# Altium project MotorDriver.PrjPCB
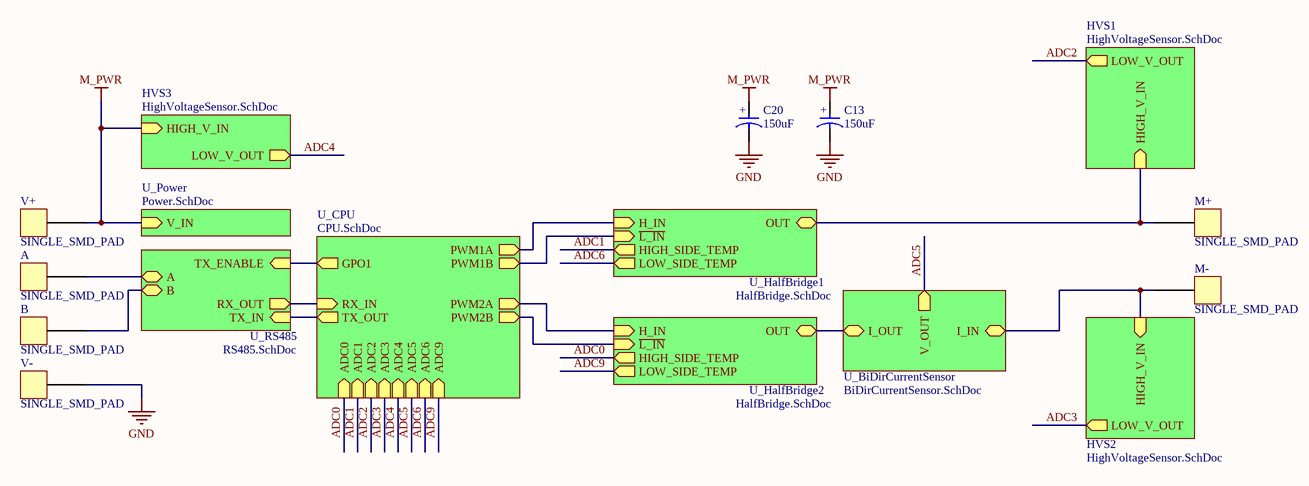
[diagram p0: MotorDriver.SchDoc]
7 sheets, 75 parts. Net scope: hierarchical (ports join the sheet entries above them; power ports are global).
Board file: MotorDriver.PcbDoc
Sheets:
  MotorDriver.SchDoc
    U_CPU = CPU.SchDoc
    U_HalfBridge1 = HalfBridge.SchDoc
    U_HalfBridge2 = HalfBridge.SchDoc
    U_BiDirCurrentSensor = BiDirCurrentSensor.SchDoc
    HVS2 = HighVoltageSensor.SchDoc
    HVS1 = HighVoltageSensor.SchDoc
    U_RS485 = RS485.SchDoc
    U_Power = Power.SchDoc
    HVS3 = HighVoltageSensor.SchDoc

## Sheet MotorDriver.SchDoc
size 381 x 241 mm

### Parts
A  SINGLE_SMD_PAD  [SINGLE_SMD_PAD]
B  SINGLE_SMD_PAD  [SINGLE_SMD_PAD]
C13  value 150uF  [MAL202137151E3]  (hidden comment: MAL202137151E3)
C20  value 150uF  [MAL202137151E3]  (hidden comment: MAL202137151E3)
M+  SINGLE_SMD_PAD  [SINGLE_SMD_PAD]
M-  SINGLE_SMD_PAD  [SINGLE_SMD_PAD]
V+  SINGLE_SMD_PAD  [SINGLE_SMD_PAD]
V-  SINGLE_SMD_PAD  [SINGLE_SMD_PAD]

### Sub-sheets
HVS1 = HighVoltageSensor.SchDoc: HIGH_V_IN (in), LOW_V_OUT (out)
HVS2 = HighVoltageSensor.SchDoc: HIGH_V_IN (in), LOW_V_OUT (out)
HVS3 = HighVoltageSensor.SchDoc: HIGH_V_IN (in), LOW_V_OUT (out)
U_BiDirCurrentSensor = BiDirCurrentSensor.SchDoc: V_OUT (out), I_IN (bidir), I_OUT (bidir)
U_CPU = CPU.SchDoc: PWM2A (out), PWM2B (out), PWM1A (out), PWM1B (out), ADC1 (in), GPO1 (out), TX_OUT (out), RX_IN (in), ADC2 (in), ADC3 (in), ADC0 (in), ADC4 (in), ADC5 (in), ADC6 (in), ADC9 (in)
U_HalfBridge1 = HalfBridge.SchDoc: OUT (bidir), H_IN (in), ~{L_IN} (in), HIGH_SIDE_TEMP (out), LOW_SIDE_TEMP (out)
U_HalfBridge2 = HalfBridge.SchDoc: OUT (bidir), H_IN (in), ~{L_IN} (in), HIGH_SIDE_TEMP (out), LOW_SIDE_TEMP (out)
U_Power = Power.SchDoc: V_IN (in)
U_RS485 = RS485.SchDoc: RX_OUT (out), TX_IN (in), TX_ENABLE (in), A (bidir), B (bidir)

### Nets
GND: C13.- C20.- V-.0
M_PWR: C13.+ C20.+ V+.0 ; sheet U_Power/V_IN, sheet HVS3/HIGH_V_IN  [project net VIN]
ADC0: sheet U_CPU/ADC0, sheet U_HalfBridge2/HIGH_SIDE_TEMP
ADC1: sheet U_CPU/ADC1, sheet U_HalfBridge1/HIGH_SIDE_TEMP
ADC2: sheet U_CPU/ADC2, sheet HVS1/LOW_V_OUT
ADC3: sheet U_CPU/ADC3, sheet HVS2/LOW_V_OUT
ADC4: sheet U_CPU/ADC4, sheet HVS3/LOW_V_OUT
ADC5: sheet U_CPU/ADC5, sheet U_BiDirCurrentSensor/V_OUT
ADC6: sheet U_CPU/ADC6, sheet U_HalfBridge1/LOW_SIDE_TEMP
ADC9: sheet U_CPU/ADC9, sheet U_HalfBridge2/LOW_SIDE_TEMP
NetA_0: A.0 ; sheet U_RS485/A
NetB_0: B.0 ; sheet U_RS485/B
NetC6_1_2: M+.0 ; sheet U_HalfBridge1/OUT, sheet HVS1/HIGH_V_IN
NetC6_2_2: sheet U_HalfBridge2/OUT, sheet U_BiDirCurrentSensor/I_OUT
NetM-_0: M-.0 ; sheet U_BiDirCurrentSensor/I_IN, sheet HVS2/HIGH_V_IN
NetU3_14: sheet U_CPU/PWM1B, sheet U_HalfBridge1/~{L_IN}
NetU3_15: sheet U_CPU/PWM2B, sheet U_HalfBridge2/~{L_IN}
NetU3_20: sheet U_CPU/PWM1A, sheet U_HalfBridge1/H_IN
NetU3_21: sheet U_CPU/PWM2A, sheet U_HalfBridge2/H_IN
NetU3_32: sheet U_CPU/GPO1, sheet U_RS485/TX_ENABLE
NetU3_33: sheet U_CPU/TX_OUT, sheet U_RS485/TX_IN
NetU3_34: sheet U_CPU/RX_IN, sheet U_RS485/RX_OUT

### Library data of the parts
C13 C20 = MAL202137151E3: CAP ALUM 150UF 40V 20% AXIAL; Supplier 1: Digi-Key; Supplier Part Number 1: 4050PHCT-ND

## Sheet CPU.SchDoc
size A
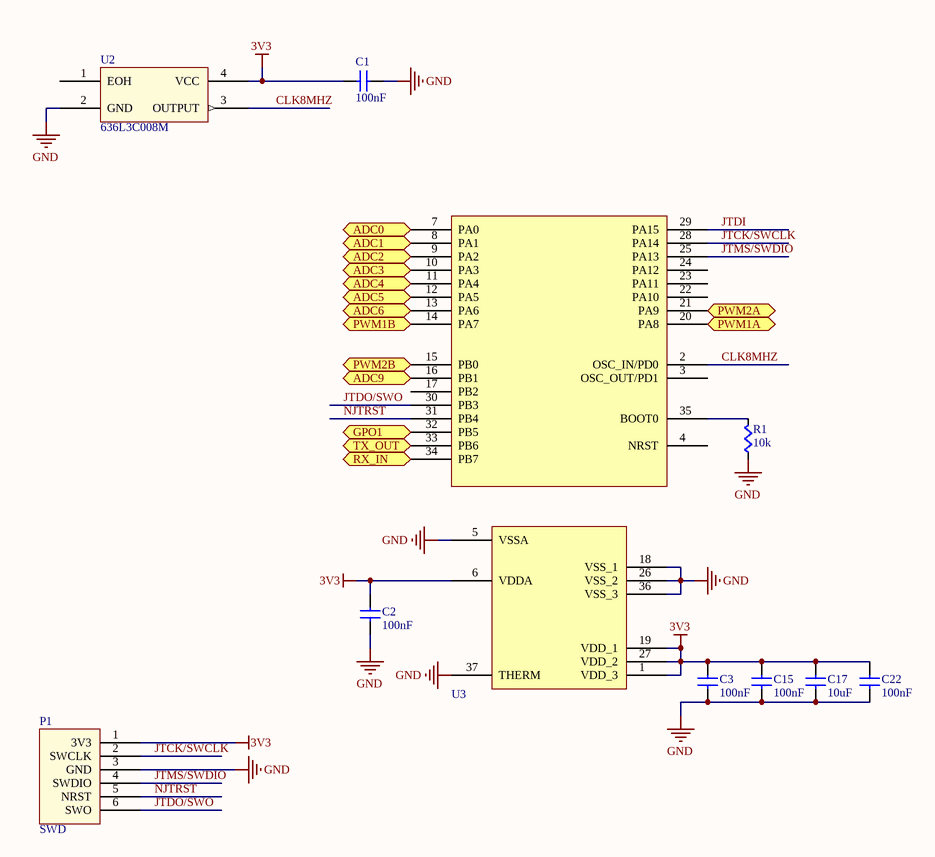
[diagram p1: CPU.SchDoc]

### Parts
C1  value 100nF  [CAPC0603]  (hidden comment: Cap)
C2  value 100nF  [CAPC0603]  (hidden comment: Cap)
C3  value 100nF  [CAPC0603]  (hidden comment: Cap)
C15  value 100nF  [CAPC0603]  (hidden comment: Cap)
C17  value 10uF  [CAPC0603]  (hidden comment: Cap)
C22  value 100nF  [CAPC0603]  (hidden comment: Cap)
P1  SWD  [SWD_STM32_SMD]
R1  value 10k  [RES0603]  (hidden comment: Res)
U2  636L3C008M  [636L3C]
U3  STM32F103TBU6  [STM32F103TBU6_NO_VIAS]  (value not drawn)

### Ports
ADC0 (in), ADC1 (in), ADC2 (in), ADC3 (in), ADC4 (in), ADC5 (in), ADC6 (in), ADC9 (in), GPO1 (out), PWM1A (out), PWM1B (out), PWM2A (out), PWM2B (out), RX_IN (in), TX_OUT (out)

### Nets
3V3: C1.1(A) C2.1(A) C3.1(A) C15.1(A) C17.1(A) C22.1(A) P1.1(3V3) U2.4(VCC) U3.1(VDD_3) U3.6(VDDA) U3.19(VDD_1) U3.27(VDD_2)
GND: C1.2(B) C2.2(B) C3.2(B) C15.2(B) C17.2(B) C22.2(B) P1.3(GND) R1.2(B) U2.2(GND) U3.5(VSSA) U3.18(VSS_1) U3.26(VSS_2) U3.36(VSS_3) U3.37(THERM)
ADC0: U3.7(PA0) ; port ADC0
ADC1: U3.8(PA1) ; port ADC1
ADC2: U3.9(PA2) ; port ADC2
ADC3: U3.10(PA3) ; port ADC3
ADC4: U3.11(PA4) ; port ADC4
ADC5: U3.12(PA5) ; port ADC5
ADC6: U3.13(PA6) ; port ADC6
ADC9: U3.16(PB1) ; port ADC9
CLK8MHZ: U2.3(OUTPUT) U3.2(OSC_IN/PD0)
JTCK/SWCLK: P1.2(SWCLK) U3.28(PA14)
JTDI: U3.29(PA15)
JTDO/SWO: P1.6(SWO) U3.30(PB3)
JTMS/SWDIO: P1.4(SWDIO) U3.25(PA13)
NJTRST: P1.5(NRST) U3.31(PB4)
NetR1_1: R1.1(A) U3.35(BOOT0)
NetU3_14: U3.14(PA7) ; port PWM1B
NetU3_15: U3.15(PB0) ; port PWM2B
NetU3_20: U3.20(PA8) ; port PWM1A
NetU3_21: U3.21(PA9) ; port PWM2A
NetU3_32: U3.32(PB5) ; port GPO1
NetU3_33: U3.33(PB6) ; port TX_OUT
NetU3_34: U3.34(PB7) ; port RX_IN

Not connected (* = marked no-connect by the designer): U2 1(EOH); U3 3(OSC_OUT/PD1) 4(NRST) 17(PB2) 22(PA10) 23(PA11) 24(PA12)

### Library data of the parts
P1 = SWD_STM32: SWD connector matching the pinout on STM Discovery Boards
U2 = 636L3C: HCMOS/TTL Clock Oscillator; Supplier 1: Digi-Key; Supplier Part Number 1: CTX1005CT-ND
U3 = STM32F103TBU6: MCU ARM 32BIT 32K FLASH 36VFQFP; Supplier 1: Digi-Key; Supplier Part Number 1: 497-11534-ND
C1-C3 C15 C17 C22 = Cap: Supplier 1: Digi-Key
  C1-C3 C15 C22: Supplier Part Number 1: 399-1095-1-ND
  C17: Supplier Part Number 1: 1276-1871-1-ND
R1 = Res: Supplier 1: Digi-Key; Supplier Part Number 1: RMCF0603JT10K0CT-ND

## Sheet HalfBridge.SchDoc
size A
Used 2 times, as channels U_HalfBridge1, U_HalfBridge2. Parts and nets are listed once, with the designators drawn on the sheet.
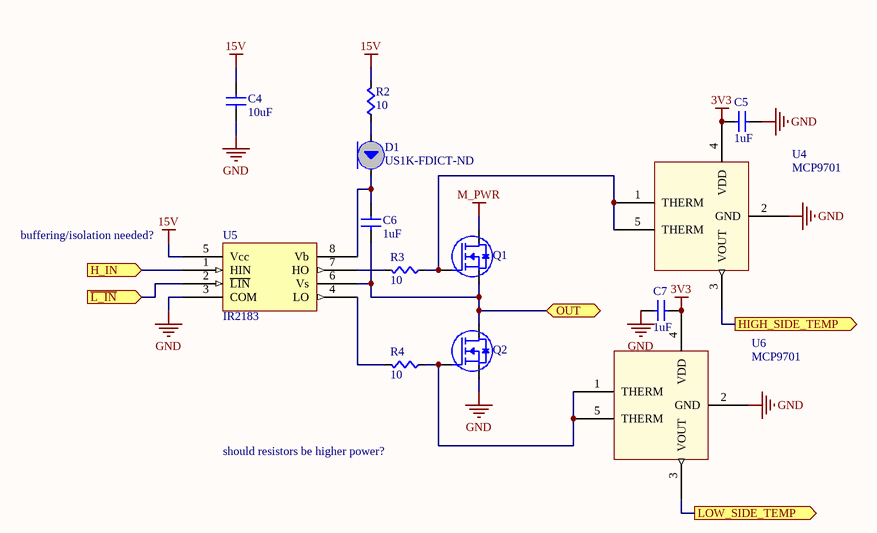
[diagram p2: HalfBridge.SchDoc]

### Parts
C4  value 10uF  [CAPC0603]  (hidden comment: Cap)
C5  value 1uF  [CAPC0603]  (hidden comment: Cap)
C6  value 1uF  [CAPC0603]  (hidden comment: Cap)
C7  value 1uF  [CAPC0603]  (hidden comment: Cap)
D1  Supplier Part Number 1: US1K-FDICT-ND  [US1K-13-F]  (hidden comment: US1K-13-F)
Q1  IRLU3636PbF  [IRLU3636PbF]  (value not drawn)
Q2  IRLU3636PbF  [IRLU3636PbF]  (value not drawn)
R2  value 10  [RES0603]  (hidden comment: Res)
R3  value 10  [RES0603]  (hidden comment: Res)
R4  value 10  [RES0603]  (hidden comment: Res)
U4  MCP9701  [MCP9701AT-E/LT]
U5  IR2183  [IR2183S]
U6  MCP9701  [MCP9701AT-E/LT]

### Ports
H_IN (in), HIGH_SIDE_TEMP (out), LOW_SIDE_TEMP (out), OUT (bidir), ~{L_IN} (in)

### Nets
3V3: C5.2(B) C7.1(A) U4.4(VDD) U6.4(VDD)
15V: C4.1(A) R2.1(A) U5.5(Vcc)
GND: C4.2(B) C5.1(A) C7.2(B) Q2.S U4.2(GND) U5.3(COM) U6.2(GND)
M_PWR: Q1.D
H_IN: U5.1(HIN) ; port H_IN
HIGH_SIDE_TEMP: U4.3(VOUT) ; port HIGH_SIDE_TEMP
~{L_IN}: U5.2(~{LIN}) ; port ~{L_IN}
LOW_SIDE_TEMP: U6.3(VOUT) ; port LOW_SIDE_TEMP
OUT: C6.2(B) Q1.S Q2.D U5.6(Vs) ; port OUT
NetC6_1: C6.1(A) D1.C U5.8(Vb)
NetD1_A: D1.A R2.2(B)
NetQ1_G: Q1.G R3.2(B) U4.1(THERM) U4.5(THERM)
NetQ2_G: Q2.G R4.2(B) U6.1(THERM) U6.5(THERM)
NetR3_1: R3.1(A) U5.7(HO)
NetR4_1: R4.1(A) U5.4(LO)

### Channels
U_HalfBridge1: designators end in _1; ports H_IN=NetU3_20 HIGH_SIDE_TEMP=ADC1 LOW_SIDE_TEMP=ADC6 OUT=NetC6_1_2 ~{L_IN}=NetU3_14
U_HalfBridge2: designators end in _2; ports H_IN=NetU3_21 HIGH_SIDE_TEMP=ADC0 LOW_SIDE_TEMP=ADC9 OUT=NetC6_2_2 ~{L_IN}=NetU3_15

### Notes on the sheet
- (near U5) buffering/isolation needed?
- should resistors be higher power?

### Library data of the parts
D1 = US1K-13-F: 1.0A SURFACE MOUNT ULTRA-FAST RECTIFIER; Supplier 1: Digi-Key
Q1 Q2 = IRLU3636PbF: HEXFET Power MOSFET; Supplier 1: Digi-Key; Supplier Part Number 1: IRLU3636PBF-ND
U4 U6 = MCP9701AT-E/LT: Low-Power Linear Active Thermistor ICs; Supplier 1: Digi-Key; Supplier Part Number 1: MCP9701AT-E/LTCT-ND
U5 = IR2183: Half-Bridge Driver; Supplier 1: Digi-Key; Supplier Part Number 1: IR2183SPBF-ND
C4-C7 = Cap: Supplier 1: Digi-Key
  C4: Supplier Part Number 1: 445-9015-1-ND
  C5-C7: Supplier Part Number 1: 587-1248-1-ND
R2-R4 = Res: Supplier 1: Digi-Key; Supplier Part Number 1: RHM10CGCT-ND

## Sheet BiDirCurrentSensor.SchDoc
size A
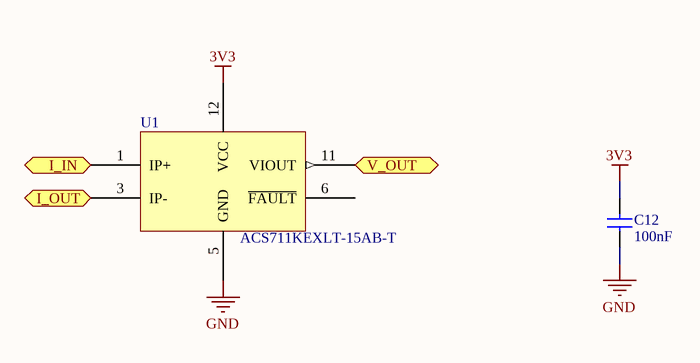
[diagram p3: BiDirCurrentSensor.SchDoc]

### Parts
C12  value 100nF  [CAPC0603]  (hidden comment: Cap)
U1  ACS711KEXLT-15AB-T  [ACS711KEXLT]

### Ports
I_IN (bidir), I_OUT (bidir), V_OUT (out)

### Nets
3V3: C12.2(B) U1.12(VCC)
GND: C12.1(A) U1.5(GND)
ADC5: U1.11(VIOUT) ; port V_OUT
NetC6_2_2: U1.3(IP-) ; port I_OUT
NetM-_0: U1.1(IP+) ; port I_IN

Not connected (* = marked no-connect by the designer): U1 6(~{FAULT})

### Library data of the parts
U1 = ACS711EEXLT: Hall Effect Linear Current Sensor with Overcurrent  Fault Output for < 100 V Isolation Applications; Supplier 1: Digi-Key; Supplier Part Number 1: 620-1483-1-ND
C12 = Cap: Supplier 1: Digi-Key; Supplier Part Number 1: 399-1095-1-ND

## Sheet HighVoltageSensor.SchDoc
size A
Used 3 times, as channels HVS2, HVS1, HVS3. Parts and nets are listed once, with the designators drawn on the sheet.
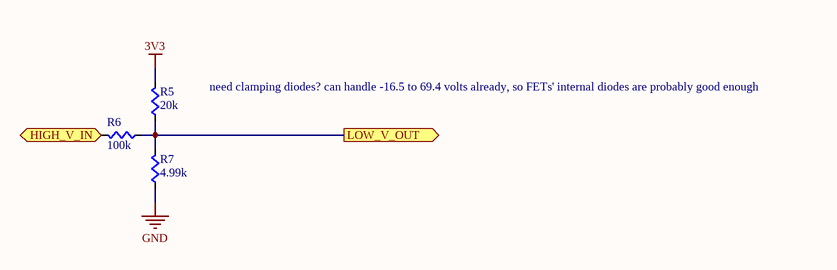
[diagram p4: HighVoltageSensor.SchDoc]

### Parts
R5  value 20k  [RES0603]  (hidden comment: Res)
R6  value 100k  [RES0603]  (hidden comment: Res)
R7  value 4.99k  [RES0603]  (hidden comment: Res)

### Ports
HIGH_V_IN (in), LOW_V_OUT (out)

### Nets
3V3: R5.1(A)
GND: R7.2(B)
HIGH_V_IN: R6.1(A) ; port HIGH_V_IN
LOW_V_OUT: R5.2(B) R6.2(B) R7.1(A) ; port LOW_V_OUT

### Channels
HVS2: designators end in _2; ports HIGH_V_IN=NetM-_0 LOW_V_OUT=ADC3
HVS1: designators end in _1; ports HIGH_V_IN=NetC6_1_2 LOW_V_OUT=ADC2
HVS3: designators end in _3; ports HIGH_V_IN=VIN LOW_V_OUT=ADC4

### Notes on the sheet
- need clamping diodes? can handle -16.5 to 69.4 volts already, so FETs' internal diodes are probably good enough

### Library data of the parts
R5-R7 = Res: Supplier 1: Digi-Key
  R5: Supplier Part Number 1: RG16P20.0KBCT-ND
  R6: Supplier Part Number 1: RG16P100KBCT-ND
  R7: Supplier Part Number 1: RG16P4.99KBCT-ND

## Sheet RS485.SchDoc
size A
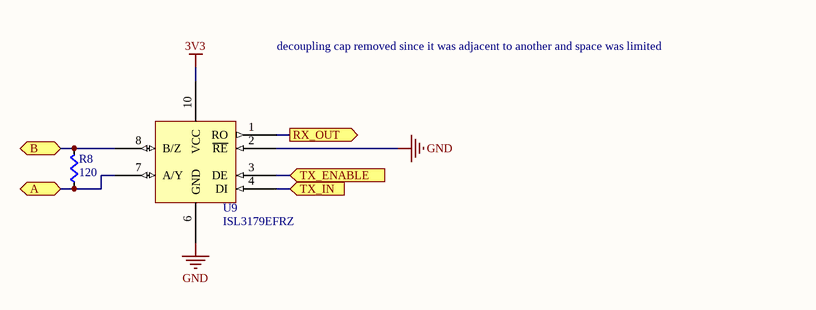
[diagram p5: RS485.SchDoc]

### Parts
R8  value 120  [RES0603]  (hidden comment: Res)
U9  ISL3179EFRZ  [ISL3179EFRZ_NO_VIAS]

### Ports
A (bidir), B (bidir), RX_OUT (out), TX_ENABLE (in), TX_IN (in)

### Nets
3V3: U9.10(VCC)
GND: U9.2(~{RE}) U9.6(GND)
NetA_0: R8.2(B) U9.7(A/Y) ; port A
NetB_0: R8.1(A) U9.8(B/Z) ; port B
NetU3_32: U9.3(DE) ; port TX_ENABLE
NetU3_33: U9.4(DI) ; port TX_IN
NetU3_34: U9.1(RO) ; port RX_OUT

### Notes on the sheet
- decoupling cap removed since it was adjacent to another and space was limited

### Library data of the parts
U9 = ISL3179EFRZ: TXRX ESD 3.3V RS-485/422 10-DFN; Supplier 1: Digi-Key; Supplier Part Number 1: ISL3179EFRZ-ND
R8 = Res: Supplier 1: Digi-Key; Supplier Part Number 1: 311-120HRCT-ND

## Sheet Power.SchDoc
size A
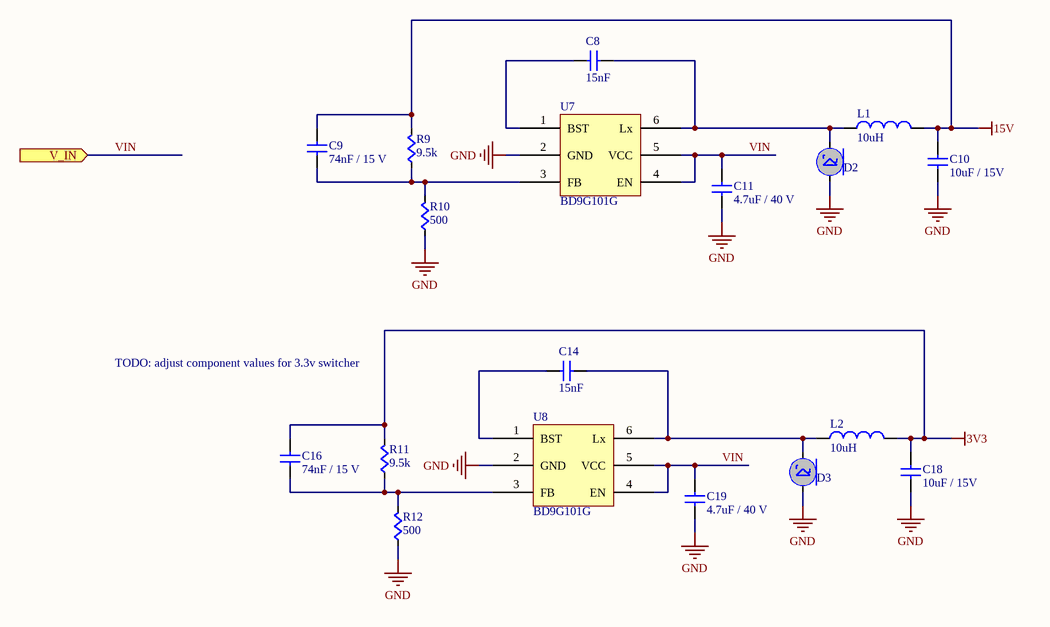
[diagram p6: Power.SchDoc]

### Parts
C8  value 15nF  [CAPC0603]  (hidden comment: Cap)
C9  value 74nF / 15 V  [CAPC0603]  (hidden comment: Cap)
C10  value 10uF / 15V  [CAPC0805]  (hidden comment: Cap)
C11  value 4.7uF / 40 V  [CAPC0805]  (hidden comment: Cap)
C14  value 15nF  [CAPC0603]  (hidden comment: Cap)
C16  value 74nF / 15 V  [CAPC0603]  (hidden comment: Cap)
C18  value 10uF / 15V  [CAPC0805]  (hidden comment: Cap)
C19  value 4.7uF / 40 V  [CAPC0805]  (hidden comment: Cap)
D2  Schottky  [US1K-13-F]  (value not drawn)
D3  Schottky  [US1K-13-F]  (value not drawn)
L1  Inductance: 10uH  [CAPC0805]  (hidden comment: Inductor)
L2  Inductance: 10uH  [CAPC0805]  (hidden comment: Inductor)
R9  value 9.5k  [RES0603]  (hidden comment: Res)
R10  value 500  [RES0603]  (hidden comment: Res)
R11  value 9.5k  [RES0603]  (hidden comment: Res)
R12  value 500  [RES0603]  (hidden comment: Res)
U7  BD9G101G  [BD9G101G]
U8  BD9G101G  [BD9G101G]

### Ports
V_IN (in)

### Nets
3V3: C16.2(B) C18.1(A) L2.2(B) R11.1(A)
15V: C9.2(B) C10.1(A) L1.2(B) R9.1(A)
GND: C10.2(B) C11.2(B) C18.2(B) C19.2(B) D2.A D3.A R10.2(B) R12.2(B) U7.2(GND) U8.2(GND)
VIN: C11.1(A) C19.1(A) U7.4(EN) U7.5(VCC) U8.4(EN) U8.5(VCC) ; port V_IN
NetC8_1: C8.1(A) U7.1(BST)
NetC8_2: C8.2(B) D2.C L1.1(A) U7.6(Lx)
NetC9_1: C9.1(A) R9.2(B) R10.1(A) U7.3(FB)
NetC14_1: C14.1(A) U8.1(BST)
NetC14_2: C14.2(B) D3.C L2.1(A) U8.6(Lx)
NetC16_1: C16.1(A) R11.2(B) R12.1(A) U8.3(FB)

### Notes on the sheet
- TODO: adjust component values for 3.3v switcher

### Library data of the parts
D2 D3 = Schottky: Schottky Diode Template; Supplier 1: Digi-Key; Supplier Part Number 1: 497-2461-1-ND
U7 U8 = BD9G101G: Simple Step-down Switching Regulators with Built-in Power MOSFET; Supplier 1: Digi-Key; Supplier Part Number 1: BD9G101G-CT-ND
C8-C11 C14 C16 C18 C19 = Cap: Supplier 1: Digi-Key
  C8 C14: Supplier Part Number 1: 1276-1967-1-ND
  C9 C16: Supplier Part Number 1: 1276-1814-1-ND
  C10 C18: Supplier Part Number 1: 490-7207-1-ND
  C11 C19: Supplier Part Number 1: 1276-1248-1-ND
L1 L2 = Inductor: Supplier Part Number 1: 445-8656-1-ND; Supplier 1: Digi-Key
R9-R12 = Res: Supplier 1: Digi-Key
  R9 R11: Supplier Part Number 1: RR08P9.53KDCT-ND
  R10 R12: Supplier Part Number 1: RR08P499DCT-ND

## Nets that join several sheets
3V3: CPU (12 pins), U_HalfBridge1 (C5_1.2 C7_1.1 U4_1.4 U6_1.4), U_HalfBridge2 (C5_2.2 C7_2.1 U4_2.4 U6_2.4), BiDirCurrentSensor (C12.2 U1.12), HVS2 (R5_2.1), HVS1 (R5_1.1), RS485 (U9.10), Power (C16.2 C18.1 L2.2 R11.1), HVS3 (R5_3.1)
15V: U_HalfBridge1 (C4_1.1 R2_1.1 U5_1.5), U_HalfBridge2 (C4_2.1 R2_2.1 U5_2.5), Power (C9.2 C10.1 L1.2 R9.1)
GND: MotorDriver (C13.- C20.- V-.0), CPU (14 pins), U_HalfBridge1 (7 pins), U_HalfBridge2 (7 pins), BiDirCurrentSensor (C12.1 U1.5), HVS2 (R7_2.2), HVS1 (R7_1.2), RS485 (U9.2 U9.6), Power (10 pins), HVS3 (R7_3.2)
VIN: MotorDriver (C13.+ C20.+ V+.0), U_HalfBridge1 (Q1_1.D), U_HalfBridge2 (Q1_2.D), Power (6 pins), HVS3 (R6_3.1)
ADC0: CPU (U3.7), U_HalfBridge2 (U4_2.3)
ADC1: CPU (U3.8), U_HalfBridge1 (U4_1.3)
ADC2: CPU (U3.9), HVS1 (R5_1.2 R6_1.2 R7_1.1)
ADC3: CPU (U3.10), HVS2 (R5_2.2 R6_2.2 R7_2.1)
ADC4: CPU (U3.11), HVS3 (R5_3.2 R6_3.2 R7_3.1)
ADC5: CPU (U3.12), BiDirCurrentSensor (U1.11)
ADC6: CPU (U3.13), U_HalfBridge1 (U6_1.3)
ADC9: CPU (U3.16), U_HalfBridge2 (U6_2.3)
NetA_0: MotorDriver (A.0), RS485 (R8.2 U9.7)
NetB_0: MotorDriver (B.0), RS485 (R8.1 U9.8)
NetC6_1_2: MotorDriver (M+.0), U_HalfBridge1 (C6_1.2 Q1_1.S Q2_1.D U5_1.6), HVS1 (R6_1.1)
NetC6_2_2: U_HalfBridge2 (C6_2.2 Q1_2.S Q2_2.D U5_2.6), BiDirCurrentSensor (U1.3)
NetM-_0: MotorDriver (M-.0), BiDirCurrentSensor (U1.1), HVS2 (R6_2.1)
NetU3_14: CPU (U3.14), U_HalfBridge1 (U5_1.2)
NetU3_15: CPU (U3.15), U_HalfBridge2 (U5_2.2)
NetU3_20: CPU (U3.20), U_HalfBridge1 (U5_1.1)
NetU3_21: CPU (U3.21), U_HalfBridge2 (U5_2.1)
NetU3_32: CPU (U3.32), RS485 (U9.3)
NetU3_33: CPU (U3.33), RS485 (U9.4)
NetU3_34: CPU (U3.34), RS485 (U9.1)